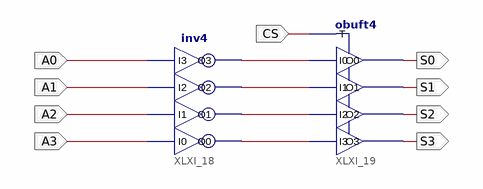
[diagram p0: schematic sheet 1]
// Xilinx ISE schematic NotX4.sch (spartan3e) as structural Verilog: 2 symbols, 9 ports
module NotX4 (
  input  A0,
  input  A1,
  input  A2,
  input  A3,
  input  CS,
  output S0,
  output S1,
  output S2,
  output S3
);

  wire XLXN_6, XLXN_7, XLXN_8, XLXN_9;

  inv4 XLXI_18 (.I0(A3), .I1(A2), .I2(A1), .I3(A0), .O0(XLXN_6), .O1(XLXN_7), .O2(XLXN_8), .O3(XLXN_9));
  obuft4 XLXI_19 (.I0(XLXN_9), .I1(XLXN_8), .I2(XLXN_7), .I3(XLXN_6), .T(CS), .O0(S0), .O1(S1), .O2(S2), .O3(S3));
endmodule
